# Altium project Modulo_Pisca_Vidros.PrjPcb
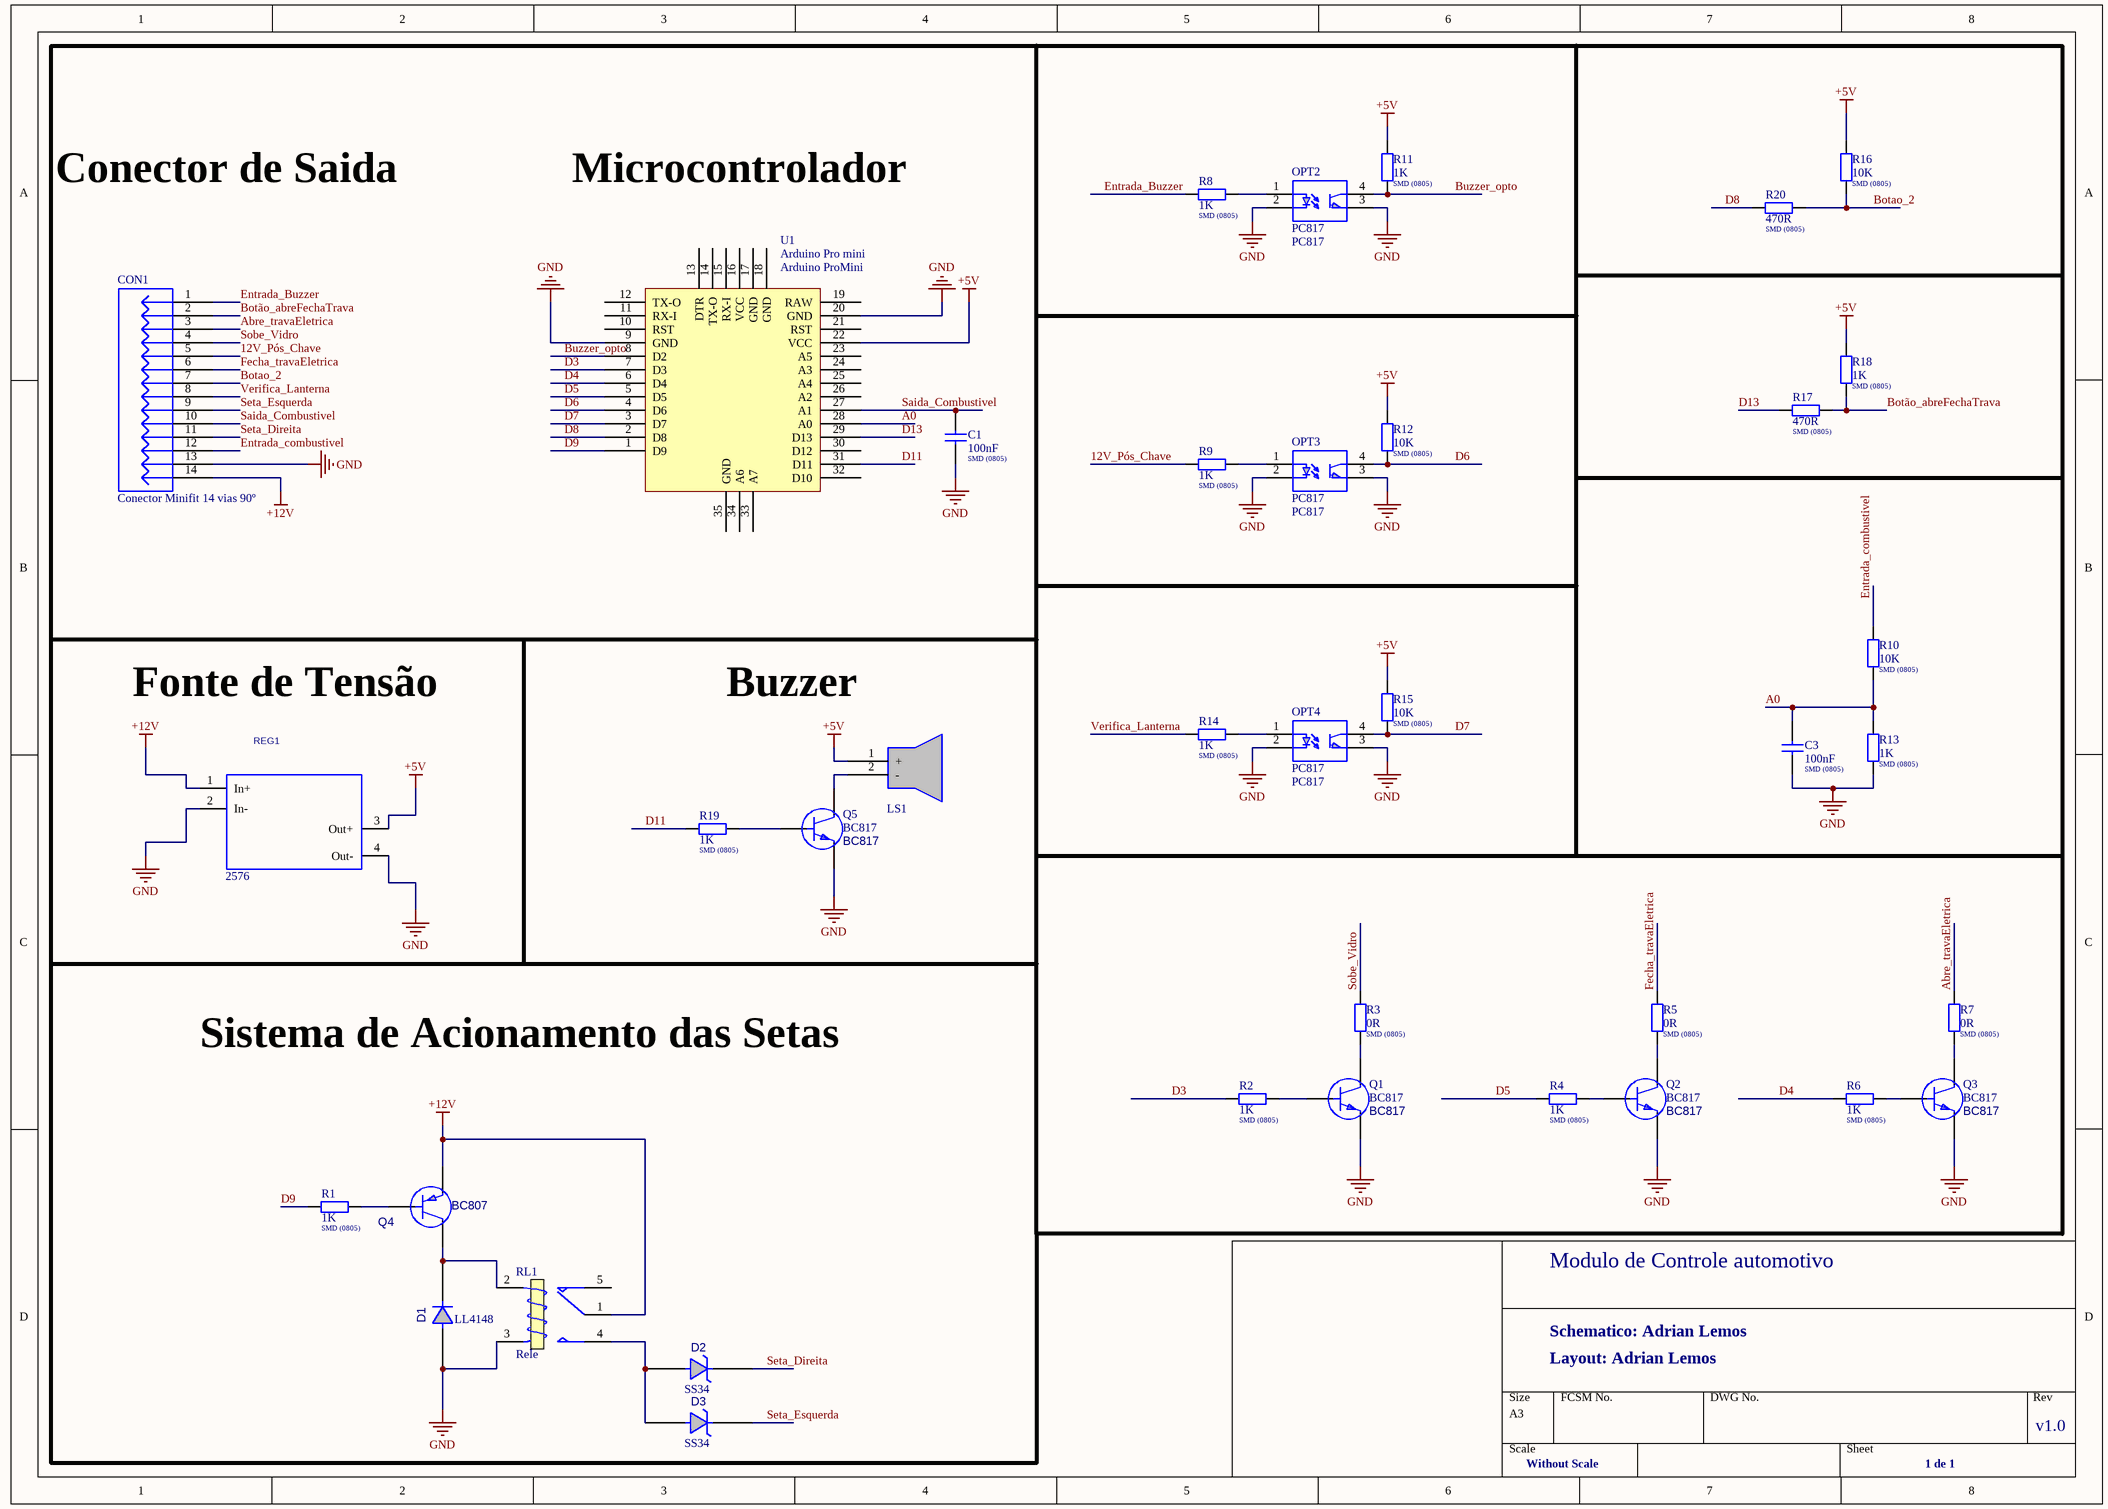
[diagram p0: Modulo_Pisca_Vidros_SCH.SchDoc]
1 sheet, 38 parts. Net scope: global (net labels, ports and power ports of the same name join across sheets).
Board file: Modulo_Pisca_Vidros_PCB.PcbDoc

## Sheet Modulo_Pisca_Vidros_SCH.SchDoc
size A3; PageSetup: Record=PageOptions|CenterHorizontal=True|CenterVertical=True|PrintScale=0.73|XCorrection=1.00|YCorrection=1.00|PrintKind=0|BorderSize=5000000|LeftOffset=0|BottomOffset=0|Orientation=2|PaperLength=1000|PaperWidth=1000|Scale=100|PaperSource=7|PrintQuality=-3|MediaType=1|DitherType=10|PrintScaleMode=1|PaperKind=A4|PaperIndex=9

### Parts
C1  Valor: 100nF  Encapsulamento: SMD (0805)  [CAP_0805]  (hidden comment: Capacitor SMD)
C3  Valor: 100nF  Encapsulamento: SMD (0805)  [CAP_0805]  (hidden comment: Capacitor SMD)
CON1  Descrição: Conector Minifit 14 vias 90º  [MFPL-14]  (hidden comment: Minifit_14vias_90º)
D1  LL4148  [SOD80C MINIMELF]
D2  SS34  [DO214AB]
D3  SS34  [DO214AB]
LS1  BUZZER  [Buzzer]  (value not drawn)
OPT2  PC817  [DIP-4 SMD]
OPT3  PC817  [DIP-4 SMD]
OPT4  PC817  [DIP-4 SMD]
Q1  BC817  [SOT23]
Q2  BC817  [SOT23]
Q3  BC817  [SOT23]
Q4  BC807  [SOT23]
Q5  BC817  [SOT23]
R1  Valor: 1K  Encapsulamento: SMD (0805)  [RES_0805]  (hidden comment: Resistor SMD)
R2  Valor: 1K  Encapsulamento: SMD (0805)  [RES_0805]  (hidden comment: Resistor SMD)
R3  Valor: 0R  Encapsulamento: SMD (0805)  [RES_0805]  (hidden comment: Resistor SMD)
R4  Valor: 1K  Encapsulamento: SMD (0805)  [RES_0805]  (hidden comment: Resistor SMD)
R5  Valor: 0R  Encapsulamento: SMD (0805)  [RES_0805]  (hidden comment: Resistor SMD)
R6  Valor: 1K  Encapsulamento: SMD (0805)  [RES_0805]  (hidden comment: Resistor SMD)
R7  Valor: 0R  Encapsulamento: SMD (0805)  [RES_0805]  (hidden comment: Resistor SMD)
R8  Valor: 1K  Encapsulamento: SMD (0805)  [RES_0805]  (hidden comment: Resistor SMD)
R9  Valor: 1K  Encapsulamento: SMD (0805)  [RES_0805]  (hidden comment: Resistor SMD)
R10  Valor: 10K  Encapsulamento: SMD (0805)  [RES_0805]  (hidden comment: Resistor SMD)
R11  Valor: 1K  Encapsulamento: SMD (0805)  [RES_0805]  (hidden comment: Resistor SMD)
R12  Valor: 10K  Encapsulamento: SMD (0805)  [RES_0805]  (hidden comment: Resistor SMD)
R13  Valor: 1K  Encapsulamento: SMD (0805)  [RES_0805]  (hidden comment: Resistor SMD)
R14  Valor: 1K  Encapsulamento: SMD (0805)  [RES_0805]  (hidden comment: Resistor SMD)
R15  Valor: 10K  Encapsulamento: SMD (0805)  [RES_0805]  (hidden comment: Resistor SMD)
R16  Valor: 10K  Encapsulamento: SMD (0805)  [RES_0805]  (hidden comment: Resistor SMD)
R17  Valor: 470R  Encapsulamento: SMD (0805)  [RES_0805]  (hidden comment: Resistor SMD)
R18  Valor: 1K  Encapsulamento: SMD (0805)  [RES_0805]  (hidden comment: Resistor SMD)
R19  Valor: 1K  Encapsulamento: SMD (0805)  [RES_0805]  (hidden comment: Resistor SMD)
R20  Valor: 470R  Encapsulamento: SMD (0805)  [RES_0805]  (hidden comment: Resistor SMD)
REG1  Modelo: 2576  [2576_Module]  (hidden comment: voltage_regulator_module)
RL1  Rele  [Rele MA1RC2 - Metaltex]
U1  Arduino Pro mini  Modelo: Arduino ProMini  [Arduino Pro Mini]

### Nets
+5V: LS1.1(+) R11.1 R12.1 R15.1 R16.2 R18.2 REG1.3(Out+) U1.22(VCC)
+12V: CON1.14 Q4.2(E) REG1.1(In+) RL1.1(COM)
GND: C1.2 C3.1 CON1.13 D1.2 OPT2.2(K) OPT2.3(EMISSOR) OPT3.2(K) OPT3.3(EMISSOR) OPT4.2(K) OPT4.3(EMISSOR) Q1.2(E) Q2.2(E) Q3.2(E) Q5.2(E) R13.1 REG1.2(In-) REG1.4(Out-) RL1.3(T2) U1.9(GND) U1.20(GND)
12V_Pós_Chave: CON1.5 R9.2
A0: C3.2 R10.1 R13.2 U1.28(A0)
Abre_travaEletrica: CON1.3 R7.2
Botao_2: CON1.7 R16.1 R20.2
Botão_abreFechaTrava: CON1.2 R17.1 R18.1
Buzzer_opto: OPT2.4(COLETOR) R11.2 U1.8(D2)
D3: R2.1 U1.7(D3)
D4: R6.1 U1.6(D4)
D5: R4.1 U1.5(D5)
D6: OPT3.4(COLETOR) R12.2 U1.4(D6)
D7: OPT4.4(COLETOR) R15.2 U1.3(D7)
D8: R20.1 U1.2(D8)
D9: R1.1 U1.1(D9)
D11: R19.1 U1.31(D11)
D13: R17.2 U1.29(D13)
Entrada_Buzzer: CON1.1 R8.2
Entrada_combustivel: CON1.12 R10.2
Fecha_travaEletrica: CON1.6 R5.2
Saida_Combustivel: C1.1 CON1.10 U1.27(A1)
Seta_Direita: CON1.11 D2.2
Seta_Esquerda: CON1.9 D3.2
Sobe_Vidro: CON1.4 R3.2
Verifica_Lanterna: CON1.8 R14.2
NetD1_1: D1.1 Q4.3(C) RL1.2(T1)
NetD2_1: D2.1 D3.1 RL1.4(NO)
NetLS1_2: LS1.2(-) Q5.3(C)
NetOPT2_1: OPT2.1(A) R8.1
NetOPT3_1: OPT3.1(A) R9.1
NetOPT4_1: OPT4.1(A) R14.1
NetQ1_1: Q1.1(B) R2.2
NetQ1_3: Q1.3(C) R3.1
NetQ2_1: Q2.1(B) R4.2
NetQ2_3: Q2.3(C) R5.1
NetQ3_1: Q3.1(B) R6.2
NetQ3_3: Q3.3(C) R7.1
NetQ4_1: Q4.1(B) R1.2
NetQ5_1: Q5.1(B) R19.2

Not connected (* = marked no-connect by the designer): RL1 5(NC); U1 10(RST) 11(RX-I) 12(TX-O) 13(DTR) 14(TX-O) 15(RX-I) 16(VCC) 17(GND) 18(GND) 19(RAW) 21(RST) 23(A5) 24(A3) 25(A4) 26(A2) 30(D12) 32(D10) 33(A7) 34(A6) 35(GND)

### Notes on the sheet
- Conector de Saida
- Microcontrolador
- Fonte de Tensão
- Buzzer
- Sistema de Acionamento das Setas
- Modulo de Controle automotivo
- Schematico: Adrian Lemos
- Layout: Adrian Lemos
- Without Scale
- 1 de 1
- v1.0

### Library data of the parts
CON1 = Minifit_14vias_90º: Minifit 14 vias 90º; Marca: Metaltex; Encapsulamento: PTH - 14 vias 90º; Modelo: MFPL-14; Observação: https://www.metaltex.com.br/assets/produtos/pdf/mf.pdf
D1 = LL4148: Diodo LL4148 Melf; Descrição: Diodo SMD LL4148; Encapsulamento: SMD MiniMelf; Valor: *; Marca: *; Observação: *; Modelo: LL4148
D2 D3 = SS34: DIODO-SCHOTTKY-SMD 3A 40V; Descrição: Diodo Schottky 3A 40V; Encapsulamento: SMD - DO214AB; Valor: *; Marca: *; Observação: *; Modelo: SS34
LS1 = BUZZER: DC Buzzer; Descrição: BUZZER 5V; Encapsulamento: PTH; Marca: *; Modelo: *; Observação: *
OPT2-OPT4 = PC817: OptoAcoplador 4 terminais; Encapsulamento: SMD; Descrição: OptoAcoplador 4 Terminais; Valor: *; Marca: *; Observação: *; Modelo: PC817
Q1-Q3 Q5 = BC817: Transistor SMD NPN; Descrição: Transistor NPN; Encapsulamento: SMD-SOT-23; Valor: *; Marca: *; Observação: *; Modelo: BC817
Q4 = BC807: Transistor SMD PNP; Encapsulamento: SMD-SOT-23; Descrição: Transistor SMD PNP; Valor: *; Marca: *; Observação: *; Modelo: BC807
R1-R20 = Resistor SMD: Descrição: Resistor SMD 5%; Marca: *; Modelo: *; Observação: *
REG1 = voltage_regulator_module: Modulo Regulador de tensão 3A; Descrição: Módulo Regulador de Tensão; Encapsulamento: módulo; Valor: *; Marca: *; Observação: *
RL1 = Rele NA/NF: Descrição: Rele Ultraminiatura reversivel; Encapsulamento: PTH; Marca: Metatex; Modelo: MA1RC2; Valor: *; Observação: *
U1 = Arduino Pro mini: Descrição: Modulo Arduino ProMini; Valor: *; Encapsulamento: *; Marca: *; Observação: *
C1 C3 = Capacitor SMD: Descrição: Capacitor SMD; Marca: *; Modelo: *; Observação: *